# EAGLE design base (EAGLE 6.1)
DOC_ID: CLK-DWG-10; DOC_PART_NO: CLK-PC-07; DOC_REV: A; DOC_TITLE: Clock Display - Base; PROJECT_NAME: Alarm Clock
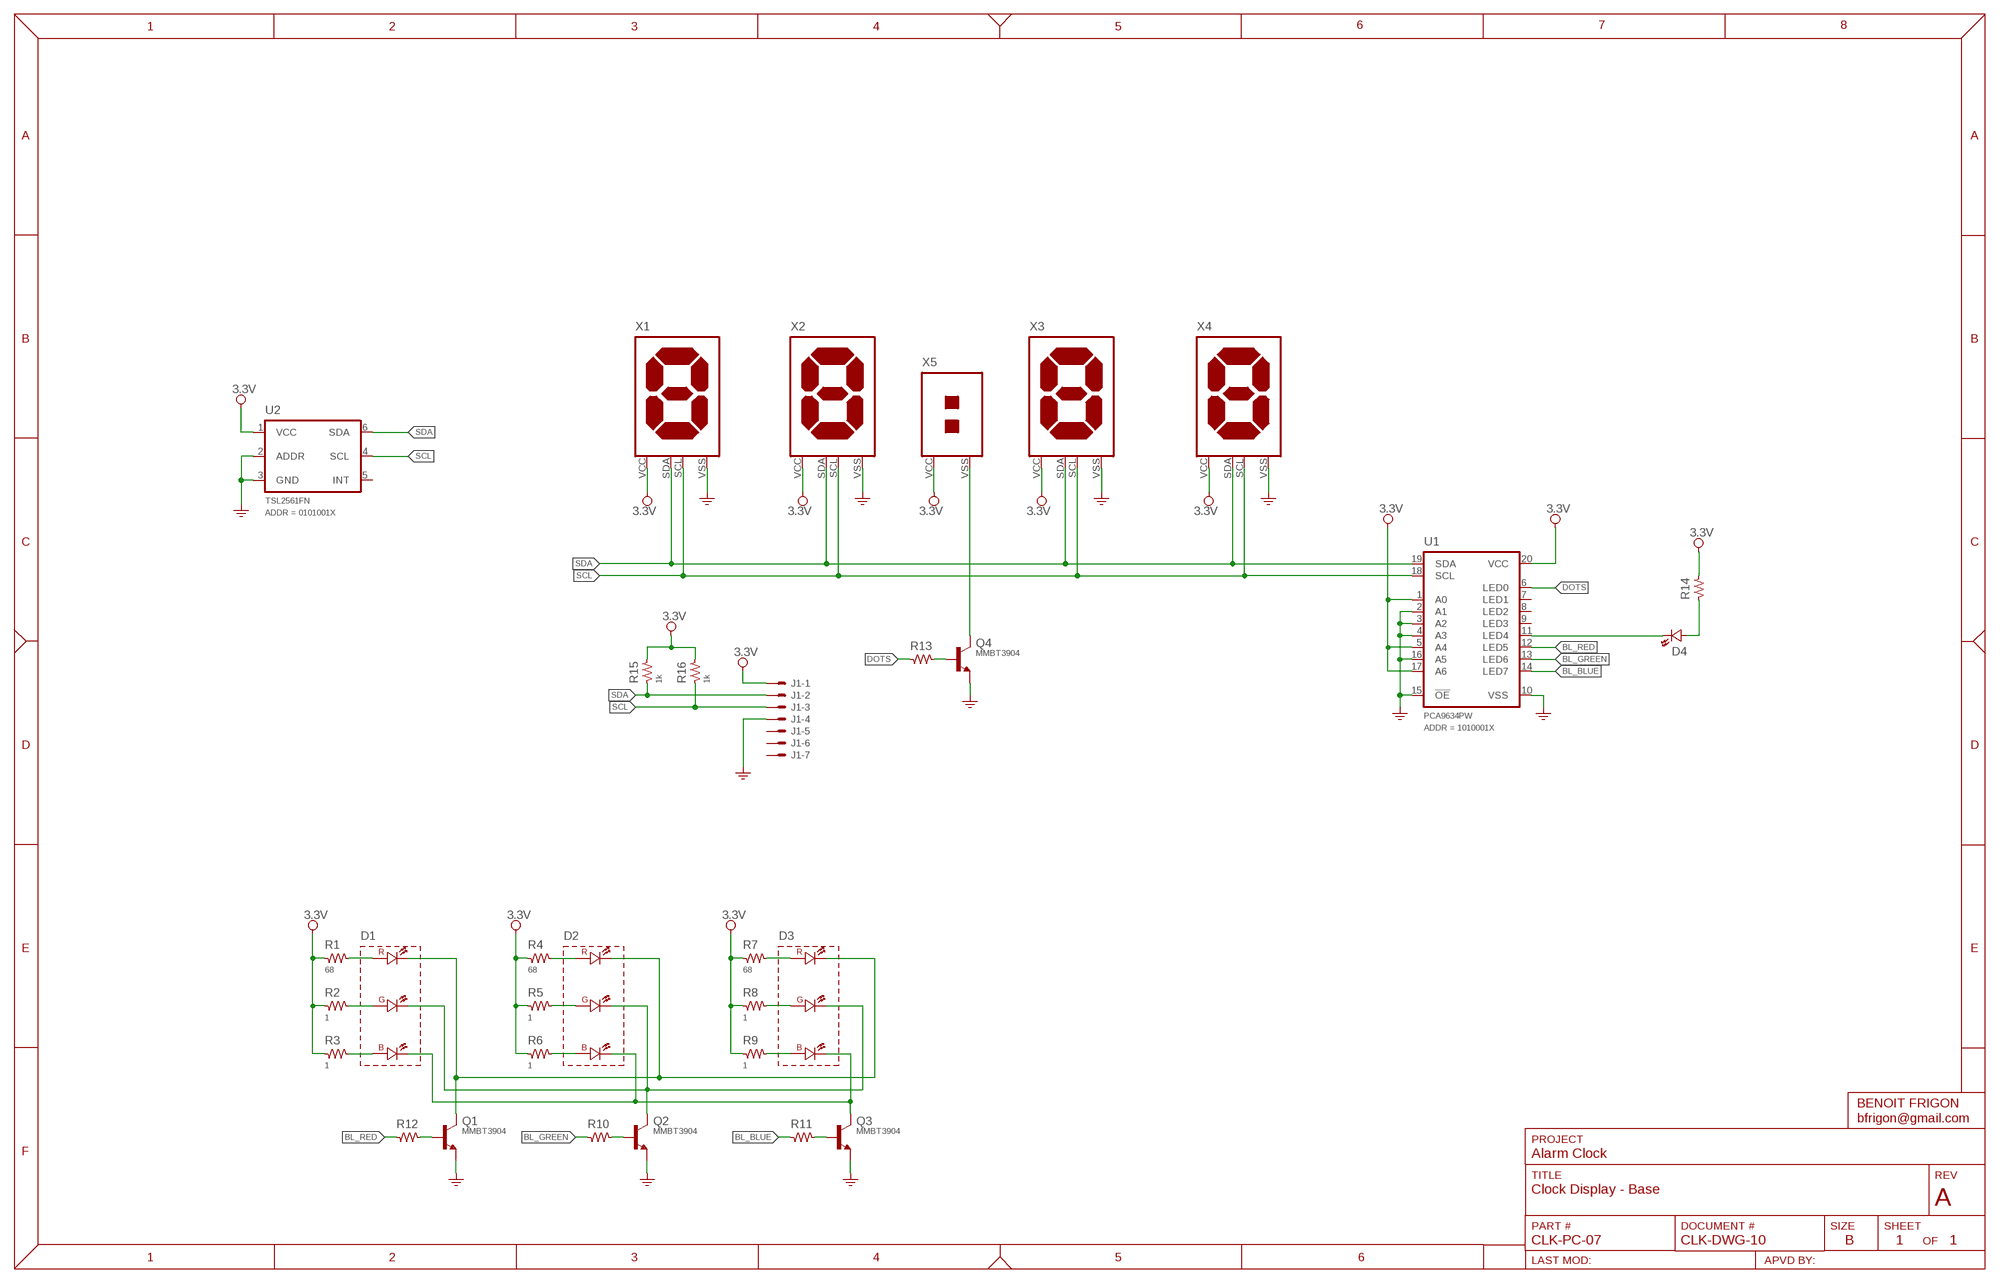
[diagram p0: schematic, sheet 1]

## Parts
D1  SMP6-RGB  [LED_RGB_PLCC6]
D2  SMP6-RGB  [LED_RGB_PLCC6]
D3  SMP6-RGB  [LED_RGB_PLCC6]
D4  {ATTR:COLOR}  LED-T1  [LED_3MM]
J1  SNG-2MM-HEADER-07-V  [DF3X-7P-2DSA]
Q1  MMBT3904  [SOT23]
Q2  MMBT3904  [SOT23]
Q3  MMBT3904  [SOT23]
Q4  MMBT3904  [SOT23]
R1  68  RES-0603  [SMD_0603]
R2  1  RES-0603  [SMD_0603]
R3  1  RES-0603  [SMD_0603]
R4  68  RES-0603  [SMD_0603]
R5  1  RES-0603  [SMD_0603]
R6  1  RES-0603  [SMD_0603]
R7  68  RES-0603  [SMD_0603]
R8  1  RES-0603  [SMD_0603]
R9  1  RES-0603  [SMD_0603]
R10  RES-0603  [SMD_0603]
R11  RES-0603  [SMD_0603]
R12  RES-0603  [SMD_0603]
R13  RES-0603  [SMD_0603]
R14  RES-0603  [SMD_0603]
R15  1k  RES-0603  [SMD_0603]
R16  1k  RES-0603  [SMD_0603]
U1  PCA9634PW  [TSSOP20]
U2  TSL2561FN  [DFN-6]
X1  CLOCK_LED_SEGMENT  [CLOCK_LED_SEGMENT]
X2  CLOCK_LED_SEGMENT  [CLOCK_LED_SEGMENT]
X3  CLOCK_LED_SEGMENT  [CLOCK_LED_SEGMENT]
X4  CLOCK_LED_SEGMENT  [CLOCK_LED_SEGMENT]
X5  CLOCK_LED_DOTS  [CLOCK_LED_DOTS]

## Nets
3.3V: J1.1 R1.1 R2.1 R3.1 R4.1 R5.1 R6.1 R7.1 R8.1 R9.1 R14.2 R15.2 R16.2 U1.1(A0) U1.5(A4) U1.17(A6) U1.20(VCC) U2.1(VCC) X1.VCC X2.VCC X3.VCC X4.VCC X5.VCC
BL_BLUE: R11.1 U1.14(LED7)
BL_GREEN: R10.1 U1.13(LED6)
BL_RED: R12.1 U1.12(LED5)
DOTS: R13.1 U1.6(LED0)
GND: J1.4 Q1.2(E) Q2.2(E) Q3.2(E) Q4.2(E) U1.2(A1) U1.3(A2) U1.4(A3) U1.10(VSS) U1.15(!OE) U1.16(A5) U2.2(ADDR) U2.3(GND) X1.VSS X2.VSS X3.VSS X4.VSS
N$1: D1.2(GA) R2.2
N$2: D1.4(RA) R1.2
N$3: D1.6(BA) R3.2
N$4: D2.4(RA) R4.2
N$5: D1.1(GK) D2.1(GK) D3.1(GK) Q2.3(C)
N$6: D1.5(BK) D2.5(BK) D3.5(BK) Q3.3(C)
N$7: D2.2(GA) R5.2
N$8: D2.6(BA) R6.2
N$9: D3.6(BA) R9.2
N$10: D3.2(GA) R8.2
N$11: D3.4(RA) R7.2
N$12: D1.3(RK) D2.3(RK) D3.3(RK) Q1.3(C)
N$13: Q2.1(B) R10.2
N$14: Q3.1(B) R11.2
N$15: Q4.3(C) X5.VSS
N$16: Q4.1(B) R13.2
N$17: Q1.1(B) R12.2
N$18: D4.K U1.11(LED4)
N$19: D4.A R14.1
SCL: J1.3 R16.1 U1.18(SCL) U2.4(SCL) X1.SCL X2.SCL X3.SCL X4.SCL
SDA: J1.2 R15.1 U1.19(SDA) U2.6(SDA) X1.SDA X2.SDA X3.SDA X4.SDA
Unconnected: J1.5 J1.6 J1.7 U1.7(LED1) U1.8(LED2) U1.9(LED3) U2.5(INT)

## Library data of the parts
D1 = Optoelectronic:SMP6-RGB: SMT RGB Led - PLCC6; MFG: BIVAR; SKU: SMP6-RGB
D2 D3 = Optoelectronic:SMP6-RGB: SMT RGB Led - PLCC6; MFG: Bivar; SKU: SMP6-RGB
D4 = Optoelectronic:LED: Led; COLOR: Green; DESCRIPTION: {DESCRIPTION} T1 (3mm) - {ATTR:COLOR}; PACKAGE: T1; SKU: -
J1 = Connectors:SNG-2MM-HEADER-07: 2mm Single Row Header - 7 pos; DESCRIPTION: {DESCRIPTION} - SMT Vertical; MFG: Hirose Electronic; PART_NO: DF3A-7P-2DSA; PRICE: 0.37; SKU: H2099-ND; SUPPLIER: Digi-Key
Q1-Q4 = Transistor:MMBT3904: NPN Transistor
R1-R16 = Passive:RES: Resistor; DESCRIPTION: {DESCRIPTION} - SMT 0603 - {VALUE}; PACKAGE: SMT 0603
U1 = IC:PCA9634: 8-bit fm+ i2c-bus LED driver The PCA9634 is an I2C-bus controlled 8-bit LED driver optimized for Red/Green/Blue/Amber (RGBA) color mixing applications. Each LED output has its own 8-bit resolution (256 steps) fixed frequency Individual PWM controller that operates at 97 kHz with a duty cycle that is adjustable from 0 % to 99.6 % to allow the LED to be set to a specific brightness value. An additional 8-bit resolution (256 steps) Group PWM controller has both a fixed frequency of 190 Hz and an adjustable frequency between 24 Hz to once every 10.73 seconds with a duty cycle that is adjustable from 0 % to 99.6 % that is used to either dim or blink all LEDs with the same value. Features 8 LED drivers. Each output programmable at: Off On Programmable LED brightness Programmable group dimming/blinking mixed with individual LED brightness 1 MHz Fast-mode Plus compatible I2C-bus interface with 30 mA high drive capability on SDA output for driving high capacitive buses 256-step (8-bit) linear programmable brightness per LED output varying from fully off (default) to maximum brightness using a 97 kHz PWM signal 256-step group brightness control allows general dimming (using a 190 Hz PWM signal) from fully off to maximum brightness (default) 256-step group blinking with frequency programmable from 24 Hz to 10.73 s and duty cycle from 0 % to 99.6 % Eight totem-pole outputs (sink 25 mA and source 10 mA at 5 V) with software programmable open-drain LED outputs selection (default at totem-pole). No input function. Output state change programmable on the Acknowledge or the STOP Command to update outputs byte-by-byte or all at the same time (default to ‘Change on STOP’). Active LOW Output Enable (OE) input pin. LED outputs programmable to 1, 0 or ‘high-impedance’ (default at power-up) when OE is HIGH, thus allowing hardware blinking and dimming of the LEDs. 7 hardware address pins allow 126 devices to be connected to the same I2C-bus 4 software programmable I2C-bus addresses (one LED Group Call address and three LED Sub Call addresses) allow groups of devices to be addressed at the same time in any combination (for example, one register used for ‘All Call’ so that all the PCA9634s on the I2C-bus can be addressed at the same time and the second register used for three different addresses so that 1⁄3 of all devices on the bus can be addressed at the same time in a group). Software enable and disable for I2C-bus address. Software Reset feature (SWRST Call) allows the device to be reset through the I2C-bus 25 MHz internal oscillator requires no external components Internal power-on reset Noise filter on SDA/SCL inputs Edge rate control on outputs No glitch on power-up Supports hot insertion Low standby current Operating power supply voltage range of 2.3 V to 5.5 V 5.5 V tolerant inputs; ADDR: 1010001X; MFG: NXP Semiconductors
U2 = Optoelectronic:TSL2561: Light-to-digital converter; ADDR: 0101001X
X1-X4 = Misc:CLOCK_LED_SEGMENT
X5 = Misc:CLOCK_LED_DOTS

## Board
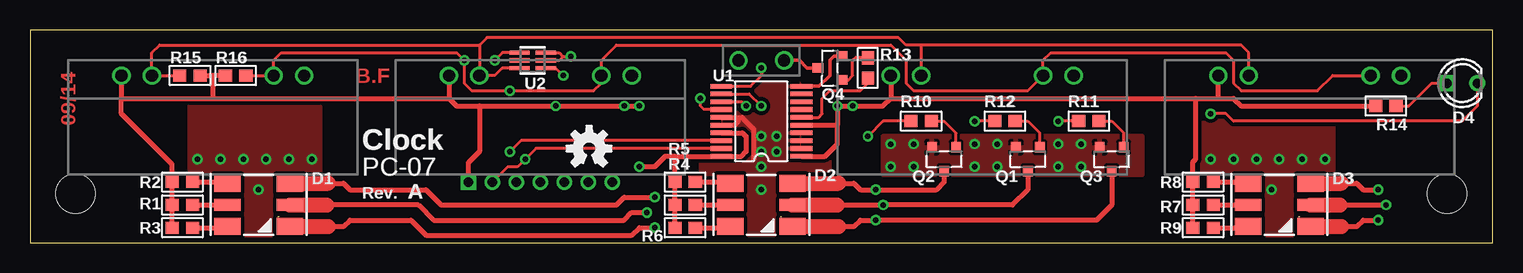
[diagram p1: board, top side]
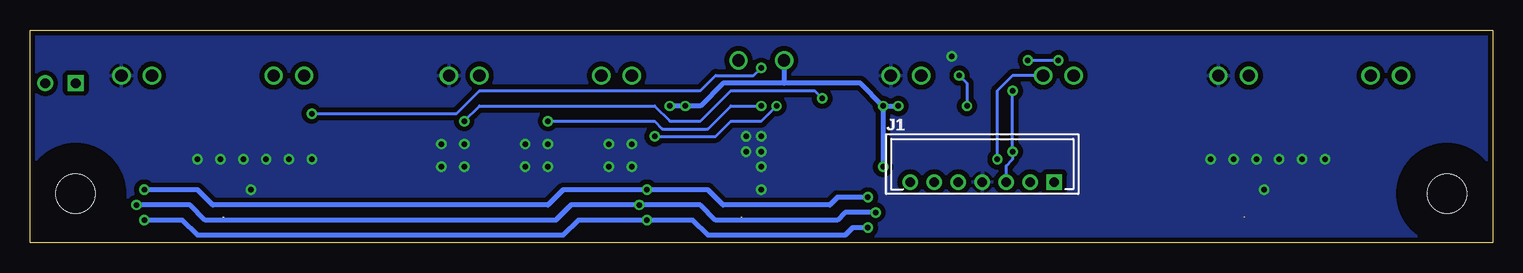
[diagram p2: board, bottom side, seen from below]

Size 121.92 x 17.78 mm. Coordinates in mm from the lower left corner, seen from the top.
Outline: 0,0 121.92,0 121.92,17.78 0,17.78 0,0
Copper layers (1*16): Top 0.035mm / dielectric 1.5mm / Bottom 0.035mm
Design rules: minimum track width 10mil, minimum drill 16mil, track to track 8mil, track to pad 8mil, pad to pad 8mil, via to via 8mil, smd to smd 8mil, copper to edge 16mil, drill to drill 8mil, minimum pad ring 10mil, minimum via ring 8mil, stop-mask expansion 4mil, vias tented up to drill 20mil, thermal gap 10mil
Holes 3.28 mm at 3.81,4.11 118.11,4.11
tRestrict: area 0,0.3 to 7.6,7.9; area 114.3,0.3 to 121.9,7.9
bRestrict: area 0,0.3 to 7.6,7.9; area 114.3,0.3 to 121.9,7.9

### Footprints (pad centres in the part's own frame; a part is rotated, then mirrored left to right if it is on the bottom)
LED_RGB_PLCC6 = smd 2.2 x 1.4: 1 2.6,1.8; 2 -2.6,1.8; 5 2.6,-1.8; 6 -2.6,-1.8 | smd 2.2 x 1: 3 2.6,0; 4 -2.6,0
LED_3MM = drill 0.8 square: A -1.27,0 | drill 0.8: K 1.27,0
DF3X-7P-2DSA = drill 0.8 square: 1 6,0 | drill 0.8: 2 4,0; 3 2,0; 4 0,0; 5 -2,0; 6 -4,0; 7 -6,0
SOT23 = smd 0.8 x 0.9: 1 -1,-1; 2 1,-1; 3 0,1
SMD_0603 = smd 1.1 x 1: 1 -0.85,0; 2 0.85,0
TSSOP20 = smd 0.38 x 1.8: 1 -2.925,-3.35; 2 -2.275,-3.35; 3 -1.625,-3.35; 4 -0.975,-3.35; 5 -0.325,-3.35; 6 0.325,-3.35; 7 0.975,-3.35; 8 1.625,-3.35; 9 2.275,-3.35; 10 2.925,-3.35; 11 2.925,3.35; 12 2.275,3.35; 13 1.625,3.35; 14 0.975,3.35; 15 0.325,3.35; 16 -0.325,3.35; 17 -0.975,3.35; 18 -1.625,3.35; 19 -2.275,3.35; 20 -2.925,3.35
DFN-6 = smd 1.7 x 0.35: 1 -1.1,0.65; 2 -1.1,0; 3 -1.1,-0.65; 4 1.1,-0.65; 5 1.1,0; 6 1.1,0.65
CLOCK_LED_SEGMENT = drill 1.016: SCL 5.08,0; SDA -5.08,0; VCC -7.62,0; VSS 7.62,0
CLOCK_LED_DOTS = drill 1.016: VCC -1.905,0; VSS 1.905,0

### Placement (x,y rotation side)
D1  19.05,3.17 0 top
D2  60.96,3.17 0 top
D3  104.14,3.17 0 top
D4  119.38,13.34 0 top
J1  42.55,5.08 0 bottom
Q1  83.19,6.99 180 top
Q2  76.2,6.99 180 top
Q3  90.17,6.99 180 top
Q4  66.67,14.61 90 top
R1  12.7,3.17 0 top
R2  12.7,5.08 0 top
R3  12.7,1.27 0 top
R4  54.61,3.17 0 top
R5  54.61,5.08 0 top
R6  54.61,1.27 0 top
R7  97.79,3.17 0 top
R8  97.79,5.08 0 top
R9  97.79,1.27 0 top
R10  74.3,10.16 0 top
R11  88.27,10.16 0 top
R12  81.28,10.16 0 top
R13  69.85,14.61 90 top
R14  113.03,11.43 180 top
R15  13.34,13.97 0 top
R16  17.14,13.97 180 top
U1  60.96,10.16 90 top
U2  41.91,15.24 180 top
U$1  [INFO_DATE]  3.81,9.78 90 top
U$3  [OPENHW_LOGO_150]  46.61,7.87 0 top
U$4  [INFO_COMPACT]  32.77,6.22 0 top
U$5  [INFO_AUTHOR]  28.57,13.97 0 top
X1  15.24,13.97 0 top
X2  42.55,13.97 0 top
X3  79.38,13.97 0 top
X4  106.68,13.97 0 top
X5  60.96,15.24 0 top

### Tracks (layer width: path | path; a pad name or v marks a point on that pad's centre or on a via)
3.3V  (via drill 0.46)
  Top 0.254: U2.1 43.83,14.59 v44.45,13.97
  Top 0.406: X1.VCC 7.62,12.06 | 7.62,12.06 15.24,12.06 | 15.24,12.06 34.92,12.06 | 34.92,12.06 35.56,11.43 37.47,11.43 | 37.47,11.43 v43.81,11.43 v50.8,11.43 | 71.75,12.06 97.16,12.06 | 97.16,12.06 99.06,12.06 | 99.06,12.06 X4.VCC | X3.VCC 71.75,12.06 | 71.75,12.06 71.12,11.43 v67.31,11.43 67.31,9.84 | X2.VCC 34.92,12.06 | R3.1 R1.1 R2.1 11.85,6.57 7.62,10.79 7.62,12.06 | R6.1 R4.1 R5.1 53.76,7.24 | 53.76,7.24 U1.20 59.3,7.24 59.69,7.62 59.69,8.89 59.4,9.19 U1.17 | 53.76,7.24 52.95,7.24 52.07,6.35 v50.8,6.35 | R9.1 R7.1 R8.1 96.94,6.77 97.16,6.99 97.16,12.06 | U1.5 67.31,9.84 | U1.1 66.29,7.24 67.31,8.26 67.31,9.84 | 99.06,12.06 100.33,12.06 100.97,11.43 R14.2 | R15.2 15.24,13.97 | 15.24,13.97 15.24,12.06 | R16.2 15.24,13.97 | 37.47,11.43 37.47,7.62 36.55,6.7 J1.1
  Bottom 0.254: v44.45,13.97 43.81,13.34 v43.81,11.43
  Bottom 0.406: v50.8,11.43 v50.8,6.35 | v50.8,11.43 52.7,13.34 59.05,13.34 | 59.05,13.34 64.14,13.34 66.04,11.43 v67.31,11.43 v68.58,11.43 | v50.8,11.43 v49.53,11.43 | X5.VCC 59.05,13.34
BL_BLUE  (via drill 0.46)
  Top 0.254: R11.1 v85.72,10.16 | U1.14 56.17,11.13 55.88,11.43 v55.88,12.06
  Bottom 0.254: v85.72,10.16 84.45,11.43 69.85,11.43 68.58,10.16 66.04,10.16 63.5,12.7 56.52,12.7 v55.88,12.06
BL_GREEN  (via drill 0.46)
  Top 0.254: R10.1 71.12,10.16 v69.85,8.89 | U1.13 59.34,11.79 v59.69,11.43
  Bottom 0.254: v69.85,8.89 64.77,8.89 63.5,10.16 60.96,10.16 v59.69,11.43
BL_RED  (via drill 0.46)
  Top 0.254: R12.1 v78.74,10.16 | v60.96,11.43 59.95,12.44 U1.12
  Bottom 0.254: v78.74,10.16 69.85,10.16 69.22,9.53 65.41,9.53 63.5,11.43 v60.96,11.43
DOTS
  Top 0.254: U1.6 65.73,10.48 66.04,10.79 66.04,12.06 66.67,12.7 69.22,12.7 69.85,13.34 R13.1
GND  (via drill 0.46)
  Top 0.254: U2.3 43.02,15.88 44.13,15.88 44.45,15.56 | 44.45,15.56 v45.09,15.56 | U2.2 44.13,15.24 44.45,15.56
  Top 0.305: Q4.2 67.04,15.61 66.67,15.24 66.67,13.97 65.79,13.09 U1.10
  Top 0.406: 60.33,6.99 60.33,9.53 59.37,10.48 U1.15 58.73,10.48 59.05,10.16 58.73,9.84 U1.16
  other vias: 71.75,6.35 73.66,6.35 71.75,8.26 73.66,8.26 80.64,8.26 80.64,6.35 78.74,6.35 78.74,8.26 87.63,8.26 85.72,8.26 85.72,6.35 87.63,6.35 13.97,6.99 15.88,6.99 17.78,6.99 19.68,6.99 21.59,6.99 23.5,6.99 98.42,6.99 100.33,6.99 102.23,6.99 104.14,6.99 106.05,6.99 107.95,6.99 60.96,8.89 62.23,8.89 62.23,7.62 60.96,7.62 60.96,6.35 60.96,4.45 103.5,4.45 19.05,4.45
  pour Bottom (isolate 0.406): 0,17.78 121.92,17.78 121.92,0 0,0
  pour Top: 71.12,5.71 92.71,5.71 92.71,8.89 71.12,8.89
  pour Top (isolate 0.305): 66.67,0.64 55.88,0.64 55.88,6.99 57.78,6.99 57.78,13.34 64.14,13.34 64.14,6.99 66.67,6.99
  pour Top (isolate 0.305): 108.58,0.64 97.79,0.64 97.79,11.43 108.58,11.43
  pour Top (isolate 0.305): 24.13,0.64 13.34,0.64 13.34,11.43 24.13,11.43
N$1
  Top 0.406: R2.2 16.11,5.08 D1.2
N$2
  Top 0.406: R1.2 D1.4
N$3
  Top 0.406: R3.2 16.11,1.27 D1.6
N$4
  Top 0.406: R4.2 D2.4
N$5  (via drill 0.46)
  Top 0.406: v112.39,4.45 111.12,4.45 110.59,4.97 109.33,4.97 | v52.07,3.81 49.53,3.81 48.9,3.17 34.29,3.17 33.02,4.45 26.67,4.45 26.14,4.97 24.87,4.97 | 67.42,4.97 68.69,4.97 69.22,4.45 v70.48,4.45 75.56,4.45 76.2,5.08 Q2.3
  Top 1.27: D1.1 24.87,4.97 | D2.1 67.42,4.97 | D3.1 109.33,4.97
  Bottom 0.406: v52.07,3.81 54.61,3.81 55.24,3.17 64.14,3.17 65.41,4.45 v70.48,4.45 77.47,4.45 78.74,3.17 106.68,3.17 107.95,4.45 v112.39,4.45
N$6  (via drill 0.46)
  Top 0.406: v112.39,1.91 111.12,1.91 110.59,1.38 109.33,1.38 | v52.07,1.27 50.8,1.27 50.16,0.64 33.02,0.64 31.75,1.91 26.67,1.91 26.14,1.38 24.87,1.38 | 67.42,1.38 68.69,1.38 69.22,1.91 v70.48,1.91 88.9,1.91 90.17,3.17 Q3.3
  Top 1.27: D1.5 24.87,1.38 | D2.5 67.42,1.38 | D3.5 109.33,1.38
  Bottom 0.406: v52.07,1.27 53.34,1.27 53.98,0.64 65.41,0.64 66.67,1.91 v70.48,1.91 76.2,1.91 77.47,0.64 107.95,0.64 109.22,1.91 v112.39,1.91
N$7
  Top 0.406: R5.2 58.66,5.08 D2.2
N$8
  Top 0.406: R6.2 58.66,1.27 D2.6
N$9
  Top 0.406: R9.2 101.2,1.27 D3.6
N$10
  Top 0.406: R8.2 101.2,5.08 D3.2
N$11
  Top 0.406: R7.2 D3.4
N$12  (via drill 0.46)
  Top 0.406: v51.44,2.54 50.16,2.54 49.53,1.91 33.66,1.91 32.38,3.17 24.77,3.17 | 67.31,3.17 v71.12,3.17 81.92,3.17 83.19,4.45 Q1.3 | 109.22,3.17 v113.03,3.17
  Top 1.27: D1.3 24.77,3.17 | D2.3 67.31,3.17 | D3.3 109.22,3.17
  Bottom 0.406: v51.44,2.54 53.98,2.54 54.61,1.91 64.77,1.91 66.04,3.17 v71.12,3.17 76.83,3.17 78.11,1.91 107.31,1.91 108.58,3.17 v113.03,3.17
N$13
  Top 0.254: Q2.1 77.2,9.16 76.2,10.16 R10.2
N$14
  Top 0.254: Q3.1 91.17,9.16 90.17,10.16 R11.2
N$15
  Top 0.305: X5.VSS 64.14,15.24 64.77,14.61 Q4.3
N$16
  Top 0.254: R13.2 68.8,15.46 68.58,15.24 68.58,13.97 68.22,13.61 Q4.1
N$17
  Top 0.254: Q1.1 84.19,9.16 83.19,10.16 R12.2
N$18  (via drill 0.46)
  Top 0.254: D4.K 120.65,11.43 119.38,10.16 100.33,10.16 99.69,10.79 v98.42,10.79 | v60.96,14.61 60.96,13.97 60.08,13.09 U1.11
  Bottom 0.254: v98.42,10.79 86.36,10.79 84.45,12.7 66.04,12.7 64.77,13.97 61.59,13.97 v60.96,14.61
N$19
  Top 0.254: R14.1 114.94,11.43 116.84,13.34 D4.A
SCL  (via drill 0.46)
  Top 0.254: X4.SCL 108.58,13.97 107.31,12.7 100.97,12.7 100.33,13.34 100.33,15.24 99.69,15.88 85.09,15.88 84.45,15.24 X3.SCL 83.19,12.7 73.66,12.7 73.03,13.34 73.03,15.24 71.75,16.51 48.9,16.51 47.62,15.24 X2.SCL 47.62,13.34 46.99,12.7 v40.01,12.7 36.83,12.7 36.2,13.34 v36.2,15.24 35.56,15.88 20.95,15.88 20.32,15.24 X1.SCL R16.1 | U1.18 40.92,8.54 v40.01,7.62 | U2.4 39.38,15.89 v38.73,15.24
  Bottom 0.254: v40.01,12.7 v40.01,7.62 40.01,6.99 40.55,6.45 J1.3 | v38.73,15.24 v36.2,15.24
SDA  (via drill 0.46)
  Top 0.254: 37.47,16.51 10.79,16.51 10.16,15.88 X1.SDA R15.1 | 37.47,16.51 X2.SDA 38.73,13.97 39.35,14.59 U2.6 | X3.SDA 74.3,16.51 | 74.3,16.51 73.03,16.51 72.39,17.14 38.1,17.14 37.47,16.51 | X4.SDA 101.6,15.88 100.97,16.51 74.3,16.51 | U1.19 42.17,7.88 v41.27,6.99 40.64,6.35 39.81,6.35 J1.2
  Bottom 0.254: v41.27,6.99 41.27,12.7 40.01,13.97 X2.SDA

### Text on the board
_tsilk: R15 | R16 | R13 | U2 | U1 | Q4 | R10 | R12 | R11 | R14 | D4 | Clock | R5 | R2 | PC-07 | R4 | Q2 | Q1 | Q3 | R8 | D1 | D2 | D3 | R1 | Rev. | A | R7 | R3 | R9 | R6
_bsilk: J1